# Altium project PMI_Split.PrjPCB
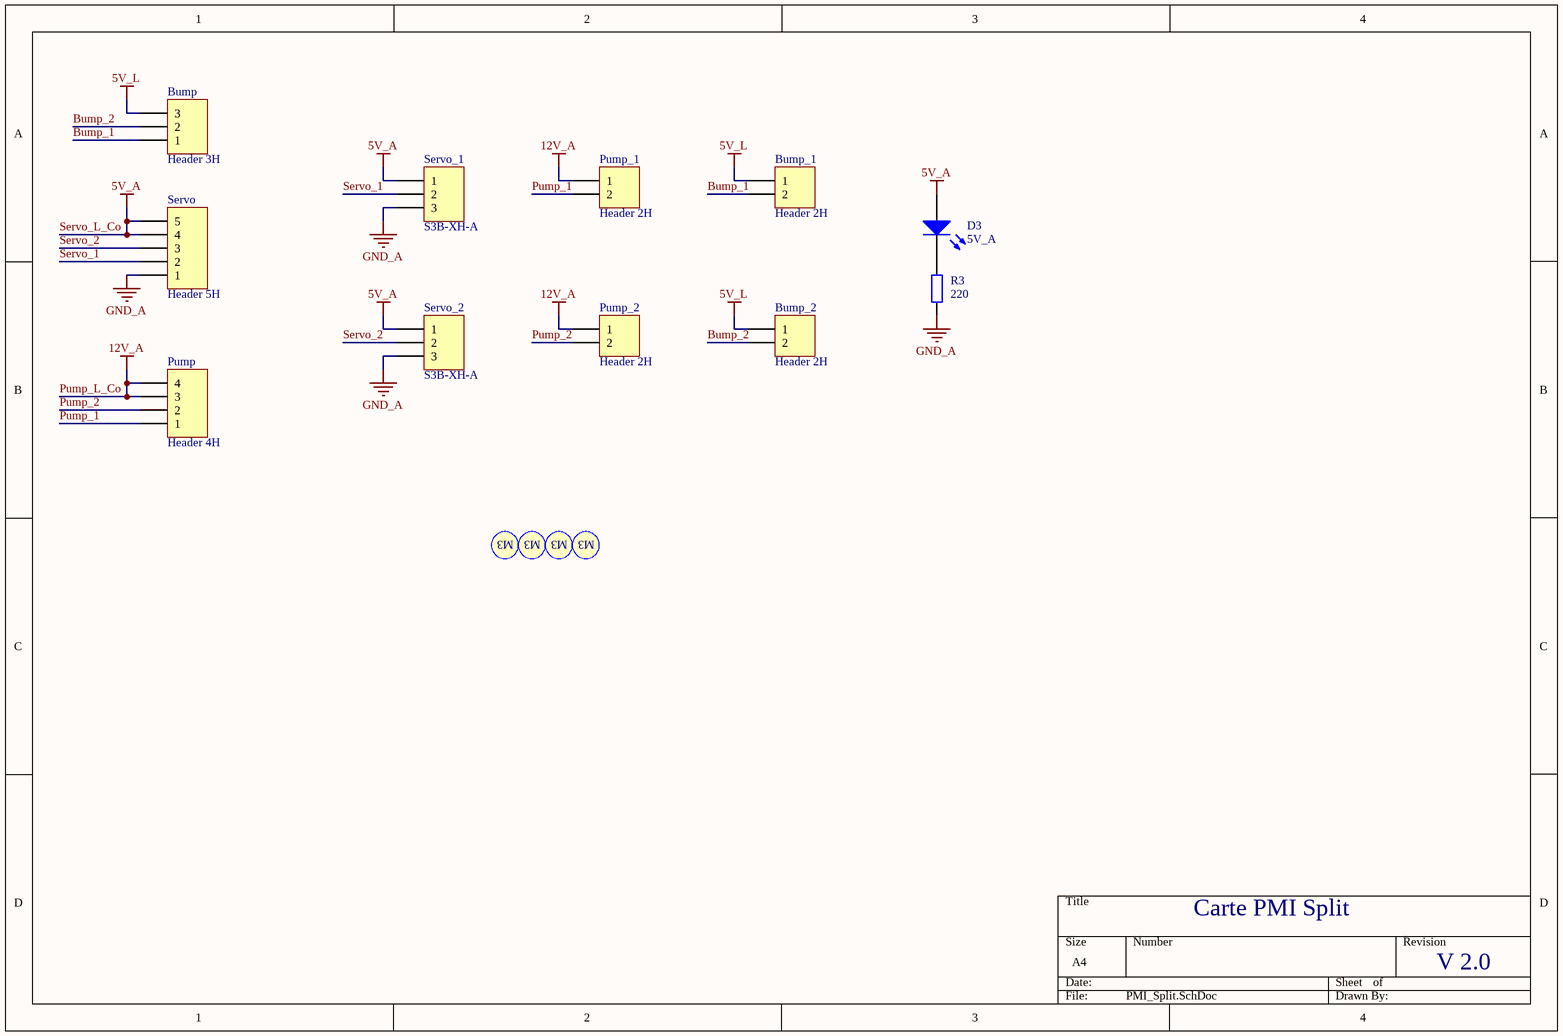
[diagram p0: PMI_Split.SchDoc]
1 sheet, 15 parts. Net scope: global (net labels, ports and power ports of the same name join across sheets).
Board file: PMI_Split.PcbDoc

## Sheet PMI_Split.SchDoc
size A4

### Parts
Bump  Header 3H  [S3B-XH-A]
Bump_1  Header 2H  [S2B-XH-A]
Bump_2  Header 2H  [S2B-XH-A]
D3  5V_A  [KP-3216SEC]
Pump  Header 4H  [S4B-XH-A]
Pump_1  Header 2H  [S2B-XH-A]
Pump_2  Header 2H  [S2B-XH-A]
R3  value 220  [Resistor 1206]  (hidden comment: Res2)
S1  Screw M3  [Screw M3]  (value not drawn)
S2  Screw M3  [Screw M3]  (value not drawn)
S3  Screw M3  [Screw M3]  (value not drawn)
S4  Screw M3  [Screw M3]  (value not drawn)
Servo  Header 5H  [S5B-XH-A]
Servo_1  S3B-XH-A  [S3B-XH-A]
Servo_2  S3B-XH-A  [S3B-XH-A]

### Nets
5V_L: Bump.3 Bump_1.1 Bump_2.1
GND_A: R3.2 Servo.1 Servo_1.3 Servo_2.3
Pump_L_Co: Pump.3 Pump.4 Pump_1.1 Pump_2.1  [also labelled 12V_A]
Servo_L_Co: D3.1(A) Servo.4 Servo.5 Servo_1.1 Servo_2.1  [also labelled 5V_A]
Bump_1: Bump.1 Bump_1.2
Bump_2: Bump.2 Bump_2.2
Pump_1: Pump.1 Pump_1.2
Pump_2: Pump.2 Pump_2.2
Servo_1: Servo.2 Servo_1.2
Servo_2: Servo.3 Servo_2.2
NetD3_2: D3.2(K) R3.1

### Notes on the sheet
- Carte PMI Split
- V 2.0
- (in symbol Screw M3) M3

### Library data of the parts
Bump Servo_1 Servo_2 = Header 3H: Header, 3-Pin, Right Angle; LatestRevisionDate: 17-Jul-2002; LatestRevisionNote: Re-released for DXP Platform.; Publisher: Altium Limited
Bump_1 Bump_2 Pump_1 Pump_2 = Header 2H: Header, 2-Pin, Right Angle; LatestRevisionDate: 17-Jul-2002; LatestRevisionNote: Re-released for DXP Platform.; Publisher: Altium Limited
D3 = LED2: Typical RED, GREEN, YELLOW, AMBER GaAs LED; Published: 8-Jun-2000; LatestRevisionDate: 17-Jul-2002; LatestRevisionNote: Re-released for DXP Platform.; PackageVersion: Feb-2002; PackageReference: 3.2X1.6X1.1; Publisher: Altium Limited; PackageDescription: SM LED; 2 Flat Leads
Pump = Header 4H: Header, 4-Pin, Right Angle; LatestRevisionDate: 17-Jul-2002; LatestRevisionNote: Re-released for DXP Platform.; Publisher: Altium Limited
R3 = Res2: Resistor; Published: 8-Jun-2000; LatestRevisionDate: 17-Jul-2002; LatestRevisionNote: Re-released for DXP Platform.; PackageReference: AXIAL-0.4; Publisher: Altium Limited; PackageDescription: Axial Device, Thru-Hole; 2 Leads; 0.4 in Pin Spacing
Servo = Header 5H: Header, 5-Pin, Right Angle; LatestRevisionDate: 17-Jul-2002; LatestRevisionNote: Re-released for DXP Platform.; Publisher: Altium Limited